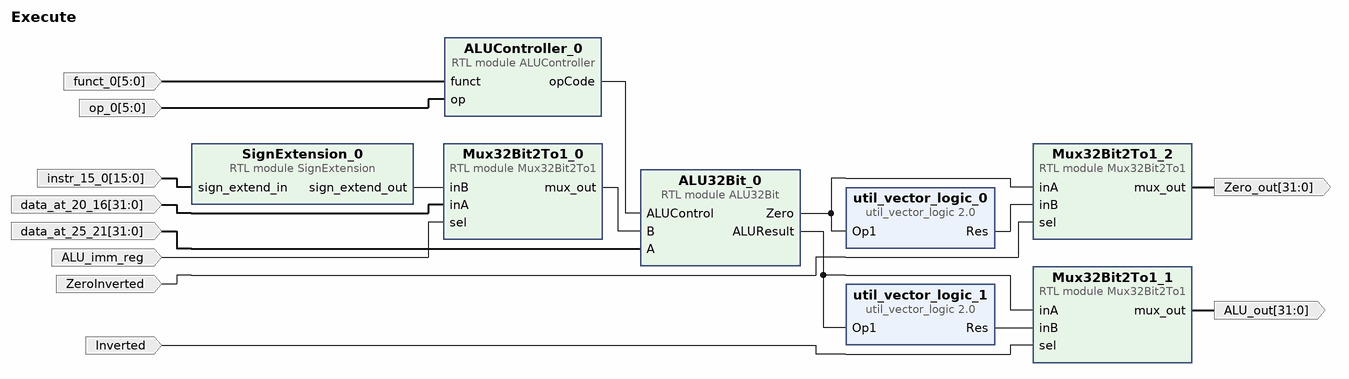
[diagram p0: block diagram of the top level]
# Vivado block design Execute, xc7k70tfbv676-1, Vivado 2020.2
create_bd_design Execute

create_bd_port -dir I -from 5 -to 0 funct_0
create_bd_port -dir I -from 5 -to 0 op_0
create_bd_port -dir I -from 31 -to 0 data_at_25_21
create_bd_port -dir I -from 31 -to 0 data_at_20_16
create_bd_port -dir I -from 15 -to 0 instr_15_0
create_bd_port -dir I ALU_imm_reg
create_bd_port -dir O -from 31 -to 0 ALU_out
create_bd_port -dir O -from 31 -to 0 Zero_out
create_bd_port -dir I ZeroInverted
create_bd_port -dir I Inverted

create_bd_cell -type module -reference ALUController ALUController_0
create_bd_cell -type module -reference ALU32Bit ALU32Bit_0
create_bd_cell -type ip -vlnv xilinx.com:ip:util_vector_logic:2.0 util_vector_logic_0
set_property -dict {CONFIG.C_OPERATION not CONFIG.C_SIZE 1} [get_bd_cells util_vector_logic_0]
create_bd_cell -type ip -vlnv xilinx.com:ip:util_vector_logic:2.0 util_vector_logic_1
set_property -dict {CONFIG.C_OPERATION not CONFIG.C_SIZE 32} [get_bd_cells util_vector_logic_1]
create_bd_cell -type module -reference Mux32Bit2To1 Mux32Bit2To1_0
create_bd_cell -type module -reference Mux32Bit2To1 Mux32Bit2To1_1
create_bd_cell -type module -reference Mux32Bit2To1 Mux32Bit2To1_2
create_bd_cell -type module -reference SignExtension SignExtension_0

# ---- connections ----

connect_bd_net -net funct_0_1 [get_bd_ports funct_0] [get_bd_pins ALUController_0/funct]
connect_bd_net -net op_0_1 [get_bd_ports op_0] [get_bd_pins ALUController_0/op]
connect_bd_net [get_bd_pins ALUController_0/opCode] [get_bd_pins ALU32Bit_0/ALUControl]
connect_bd_net -net A_0_1 [get_bd_ports data_at_25_21] [get_bd_pins ALU32Bit_0/A]
connect_bd_net -net inA_0_1 [get_bd_ports data_at_20_16] [get_bd_pins Mux32Bit2To1_0/inA]
connect_bd_net -net in_0_1 [get_bd_ports instr_15_0] [get_bd_pins SignExtension_0/sign_extend_in]
connect_bd_net -net SignExtension_0_out [get_bd_pins SignExtension_0/sign_extend_out] [get_bd_pins Mux32Bit2To1_0/inB]
connect_bd_net -net sel_0_1 [get_bd_ports ALU_imm_reg] [get_bd_pins Mux32Bit2To1_0/sel]
connect_bd_net -net Mux32Bit2To1_0_out [get_bd_pins Mux32Bit2To1_0/mux_out] [get_bd_pins ALU32Bit_0/B]
connect_bd_net [get_bd_pins ALU32Bit_0/ALUResult] [get_bd_pins util_vector_logic_1/Op1] [get_bd_pins Mux32Bit2To1_1/inA]
connect_bd_net [get_bd_pins ALU32Bit_0/Zero] [get_bd_pins util_vector_logic_0/Op1] [get_bd_pins Mux32Bit2To1_2/inA]
connect_bd_net [get_bd_pins util_vector_logic_0/Res] [get_bd_pins Mux32Bit2To1_2/inB]
connect_bd_net [get_bd_pins util_vector_logic_1/Res] [get_bd_pins Mux32Bit2To1_1/inB]
connect_bd_net -net Mux32Bit2To1_1_out [get_bd_pins Mux32Bit2To1_1/mux_out] [get_bd_ports ALU_out]
connect_bd_net -net Mux32Bit2To1_2_out [get_bd_pins Mux32Bit2To1_2/mux_out] [get_bd_ports Zero_out]
connect_bd_net -net sel_0_2 [get_bd_ports ZeroInverted] [get_bd_pins Mux32Bit2To1_2/sel]
connect_bd_net -net sel_1_1 [get_bd_ports Inverted] [get_bd_pins Mux32Bit2To1_1/sel]

validate_bd_design
save_bd_design
